# EAGLE design ecu-nowy (EAGLE 5.10)
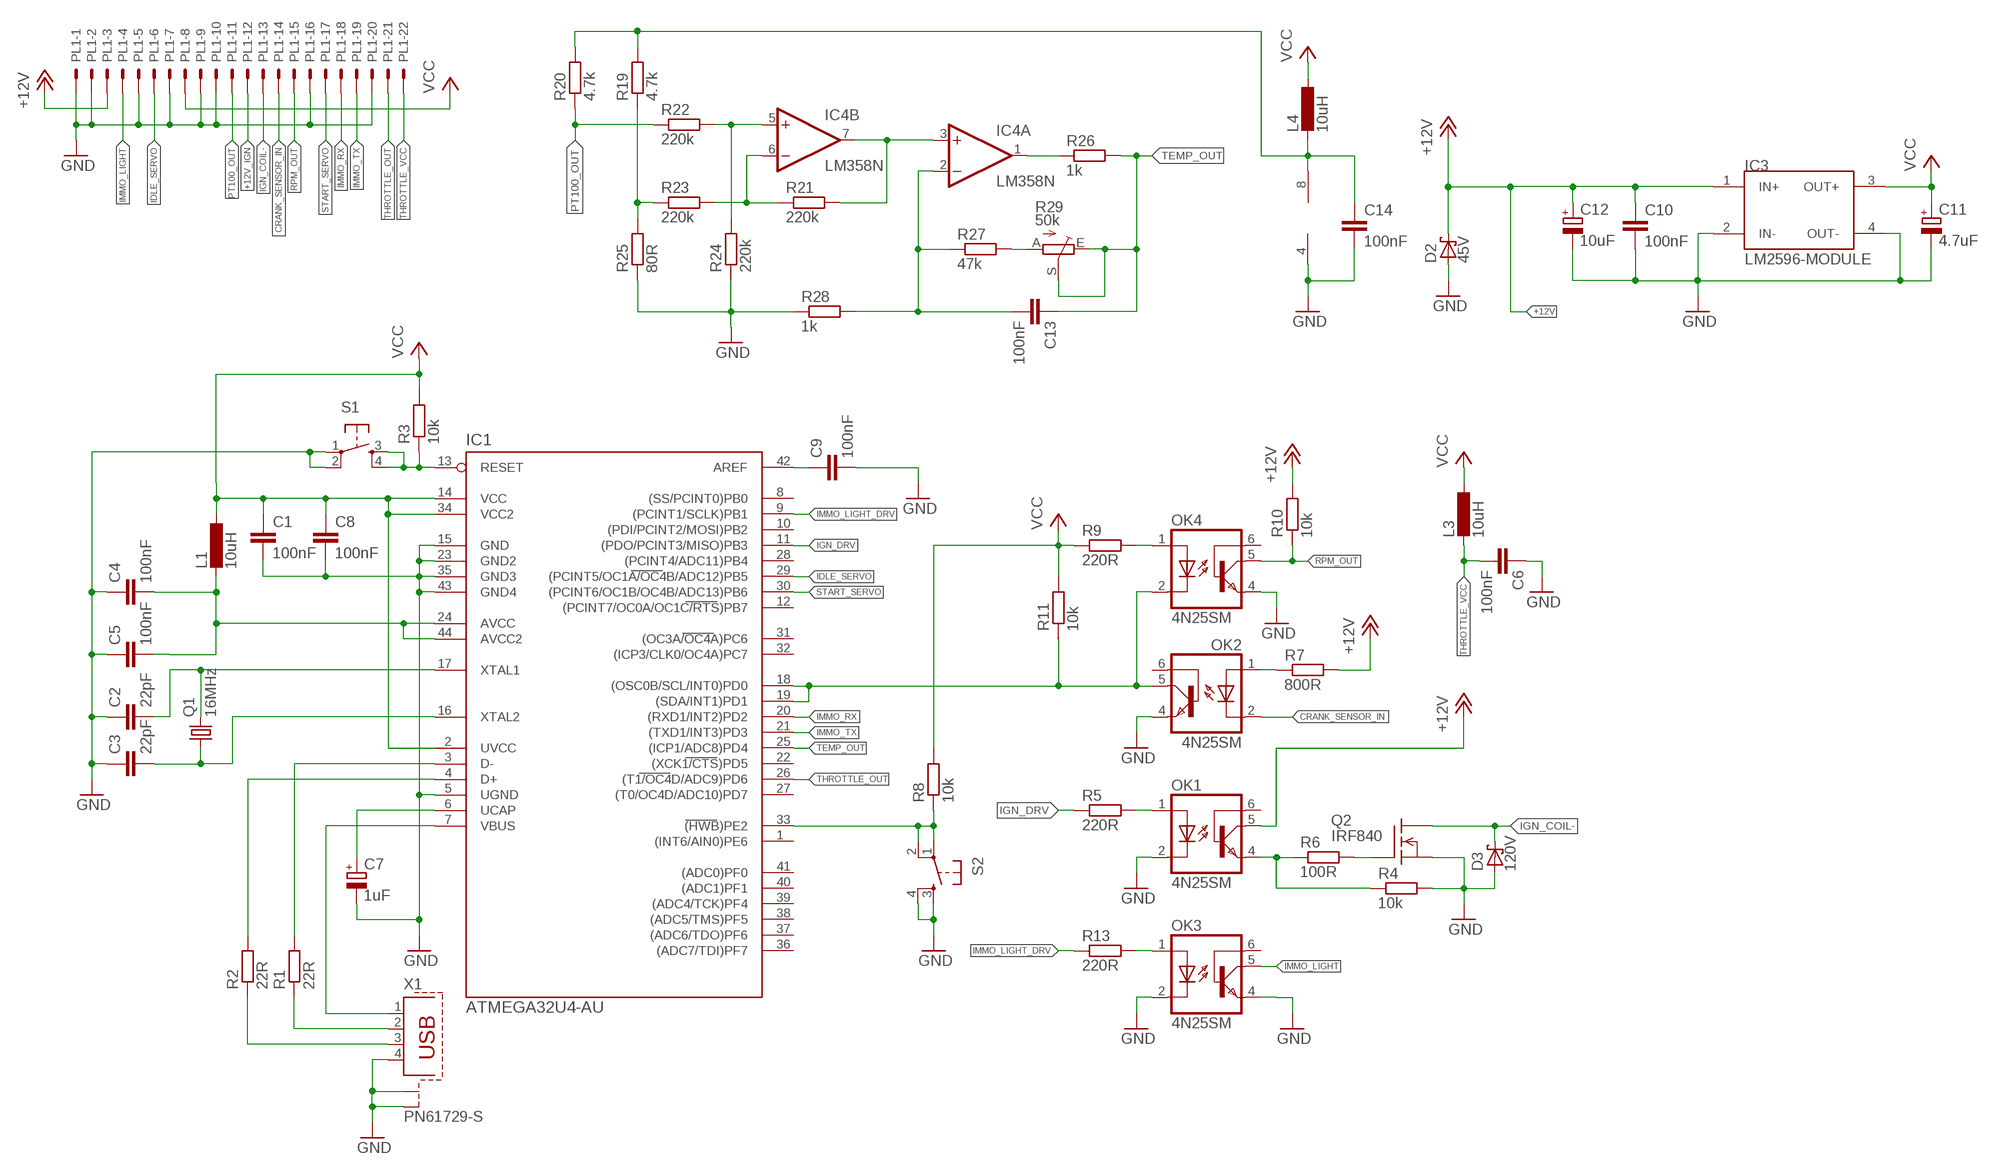
[diagram p0: schematic, sheet 1]

## Parts
C1  100nF  C-EUC0805  [C0805]
C2  22pF  C-EUC0805  [C0805]
C3  22pF  C-EUC0805  [C0805]
C4  100nF  C-EUC0805  [C0805]
C5  100nF  C-EUC0805  [C0805]
C6  100nF  C-EUC0805  [C0805]
C7  1uF  CPOL-EU153CLV-0405  [153CLV-0405]
C8  100nF  C-EUC0805  [C0805]
C9  100nF  C-EUC0805  [C0805]
C10  100nF  C-EUC0805  [C0805]
C11  4.7uF  CPOL-EU140CLH-0810  [140CLH-0810]
C12  10uF  CPOL-EU140CLH-0810  [140CLH-0810]
C13  100nF  C-EUC0805  [C0805]
C14  100nF  C-EUC0805  [C0805]
D2  45V  P4KEXX  [DO41-10]
D3  120V  P4KEXX  [DO41-10]
IC1  ATMEGA32U4-AU  [TQFP44]
IC3  LM2596-MODULE  [LM2596-MODULE]
IC4  LM358N  [DIL08]
L1  10uH  L-EU0207/10  [0207/10]
L3  10uH  L-EU0207/10  [0207/10]
L4  10uH  L-EU0207/10  [0207/10]
OK1  4N25SM  [DIL6-SMD]
OK2  4N25SM  [DIL6-SMD]
OK3  4N25SM  [DIL6-SMD]
OK4  4N25SM  [DIL6-SMD]
PL1  555X-22H  [5569-22]
Q1  16MHz  CRYSTALHC49UP  [HC49UP]
Q2  IRF840  [TO220]
R1  22R  R-EU_R0805  [R0805]
R2  22R  R-EU_R0805  [R0805]
R3  10k  R-EU_R0805  [R0805]
R4  10k  R-EU_R0805  [R0805]
R5  220R  R-EU_R0805  [R0805]
R6  100R  R-EU_R0805  [R0805]
R7  800R  R-EU_R0805  [R0805]
R8  10k  R-EU_R0805  [R0805]
R9  220R  R-EU_R0805  [R0805]
R10  10k  R-EU_R0805  [R0805]
R11  10k  R-EU_R0805  [R0805]
R13  220R  R-EU_R0805  [R0805]
R19  4.7k  R-EU_R0805  [R0805]
R20  4.7k  R-EU_R0805  [R0805]
R21  220k  R-EU_R0805  [R0805]
R22  220k  R-EU_R0805  [R0805]
R23  220k  R-EU_R0805  [R0805]
R24  220k  R-EU_R0805  [R0805]
R25  80R  R-EU_R0805  [R0805]
R26  1k  R-EU_R0805  [R0805]
R27  47k  R-EU_R0805  [R0805]
R28  1k  R-EU_R0805  [R0805]
R29  50k  TRIM_EU-S75P  [S75P]
S1  TAC_SWITCHPTH  [TACTILE-PTH]
S2  TAC_SWITCHPTH  [TACTILE-PTH]
X1  PN61729-S  [PN61729-S]

## Nets
+12V: C10.1 C12.+ D2.C IC3.1(IN+) OK1.5(COL) PL1.3 R7.2 R10.2
+12V_IGN: PL1.12
CRANK_SENSOR_IN: OK2.2(C) PL1.14
GND: C1.2 C2.1 C3.1 C4.1 C5.1 C6.1 C7.- C8.2 C9.2 C10.2 C11.- C12.- C14.2 D2.A D3.A IC1.5(UGND) IC1.15(GND) IC1.23(GND2) IC1.35(GND3) IC1.43(GND4) IC3.2(IN-) IC3.4(OUT-) IC4.4(P:V-) OK1.2(C) OK2.4(EMI) OK3.2(C) OK3.4(EMI) OK4.4(EMI) PL1.1 PL1.2 PL1.5 PL1.7 PL1.9 PL1.10 PL1.16 PL1.20 Q2.3(S) R4.2 R24.1 R25.1 R28.1 S1.1 S1.2 S2.3 S2.4 X1.4 X1.S1 X1.S2
IDLE_SERVO: IC1.29((PCINT5/OC1A/OC4B/ADC12)PB5) PL1.6
IGN_COIL-: D3.C PL1.13 Q2.2(D)
IGN_DRV: IC1.11((PDO/PCINT3/MISO)PB3) R5.1
IMMO_LIGHT: OK3.5(COL) PL1.4
IMMO_LIGHT_DRV: IC1.9((PCINT1/SCLK)PB1) R13.1
IMMO_RX: IC1.20((RXD1/INT2)PD2) PL1.18
IMMO_TX: IC1.21((TXD1/INT3)PD3) PL1.19
N$1: C4.2 C5.2 IC1.24(AVCC) IC1.44(AVCC2) L1.2
N$2: C14.1 IC4.8(P:V+) L4.2 R19.2 R20.2
N$3: C2.2 IC1.17(XTAL1) Q1.2
N$4: C3.2 IC1.16(XTAL2) Q1.1
N$5: IC1.13(RESET) R3.1 S1.3 S1.4
N$6: C7.+ IC1.6(UCAP)
N$7: IC1.33((HWB)PE2) R8.1 S2.1 S2.2
N$8: C9.1 IC1.42(AREF)
N$10: IC1.7(VBUS) X1.1
N$11: R1.1 X1.2
N$12: R2.1 X1.3
N$13: IC1.3(D-) R1.2
N$14: Q2.1(G) R6.2
N$15: OK1.1(A) R5.2
N$16: OK1.4(EMI) R4.1 R6.1
N$17: IC1.18((OSC0B/SCL/INT0)PD0) IC1.19((SDA/INT1)PD1) OK2.5(COL) OK4.2(C) R11.1
N$18: OK2.1(A) R7.1
N$21: OK4.1(A) R9.2
N$22: IC1.4(D+) R2.2
N$24: OK3.1(A) R13.2
N$29: R19.1 R23.1 R25.2
N$32: IC4.6(B:-IN) R21.1 R23.2
N$33: IC4.3(A:+IN) IC4.7(B:OUT) R21.2
N$34: IC4.5(B:+IN) R22.2 R24.2
N$35: IC4.1(A:OUT) R26.1
N$36: C13.2 IC4.2(A:-IN) R27.1 R28.2
N$38: R27.2 R29.A
PT100_OUT: PL1.11 R20.1 R22.1
RPM_OUT: OK4.5(COL) PL1.15 R10.1
START_SERVO: IC1.30((PCINT6/OC1B/OC4B/ADC13)PB6) PL1.17
TEMP_OUT: C13.1 IC1.25((ICP1/ADC8)PD4) R26.2 R29.E R29.S
THROTTLE_OUT: IC1.26((T1/OC4D/ADC9)PD6) PL1.21
THROTTLE_VCC: C6.2 L3.2 PL1.22
VCC: C1.1 C8.1 C11.+ IC1.2(UVCC) IC1.14(VCC) IC1.34(VCC2) IC3.3(OUT+) L1.1 L3.1 L4.1 PL1.8 R3.2 R8.2 R9.1 R11.2
Unconnected: IC1.1((INT6/AIN0)PE6) IC1.8((SS/PCINT0)PB0) IC1.10((PDI/PCINT2/MOSI)PB2) IC1.12((PCINT7/OC0A/OC1C/RTS)PB7) IC1.22((XCK1/CTS)PD5) IC1.27((T0/OC4D/ADC10)PD7) IC1.28((PCINT4/ADC11)PB4) IC1.31((OC3A/OC4A)PC6) IC1.32((ICP3/CLK0/OC4A)PC7) IC1.36((ADC7/TDI)PF7) IC1.37((ADC6/TDO)PF6) IC1.38((ADC5/TMS)PF5) IC1.39((ADC4/TCK)PF4) IC1.40((ADC1)PF1) IC1.41((ADC0)PF0) OK1.6(BAS) OK2.6(BAS) OK3.6(BAS) OK4.6(BAS)

## Library data of the parts
C1-C5 C8-C10 = resistor:C-EU: CAPACITOR, European symbol
C6 C13 C14 = rcl:C-EU: CAPACITOR, European symbol
C7 C11 C12 = rcl:CPOL-EU: POLARIZED CAPACITOR, European symbol
D2 D3 = diode:P4KEXX: DIODE transient-voltage suppressor
IC1 = mega32U4:ATMEGA32U4-AU
IC3 = moja:LM2596-MODULE
IC4 = linear:LM358: OP AMP also LM158; LM258; LM2904 Source: http://cache.national.com/ds/LM/LM158.pdf
L1 L3 L4 = rcl:L-EU: INDUCTOR, European symbol
OK1-OK4 = optocoupler:4N*?M: General Purpose 6-Pin Phototransistor Optocouplers Source: http://www.fairchildsemi.com/ds/4N/4N35-M.pdf
PL1 = con-molex-2:555X-22: Mini FIT connector 22 way
Q1 = crystal:CRYSTAL: CRYSTAL; OC_FARNELL: unknown; OC_NEWARK: unknown
Q2 = transistor-fet:IRF840: N-Channel Enhancement MOSFET (HEXFET); 500V; 8A; 0,85Ohm
R1-R11 R13 R19-R28 = rcl:R-EU_: RESISTOR, European symbol
R29 = pot:TRIM_EU-: POTENTIOMETER
S1 S2 = SparkFun:TAC_SWITCH: Momentary Switch Button commonly used for reset or general input. Spark Fun Electronics SKU : COM-00097
X1 = con-berg:PN61729-S: BERG USB connector; OC_FARNELL: unknown; OC_NEWARK: unknown

## Board
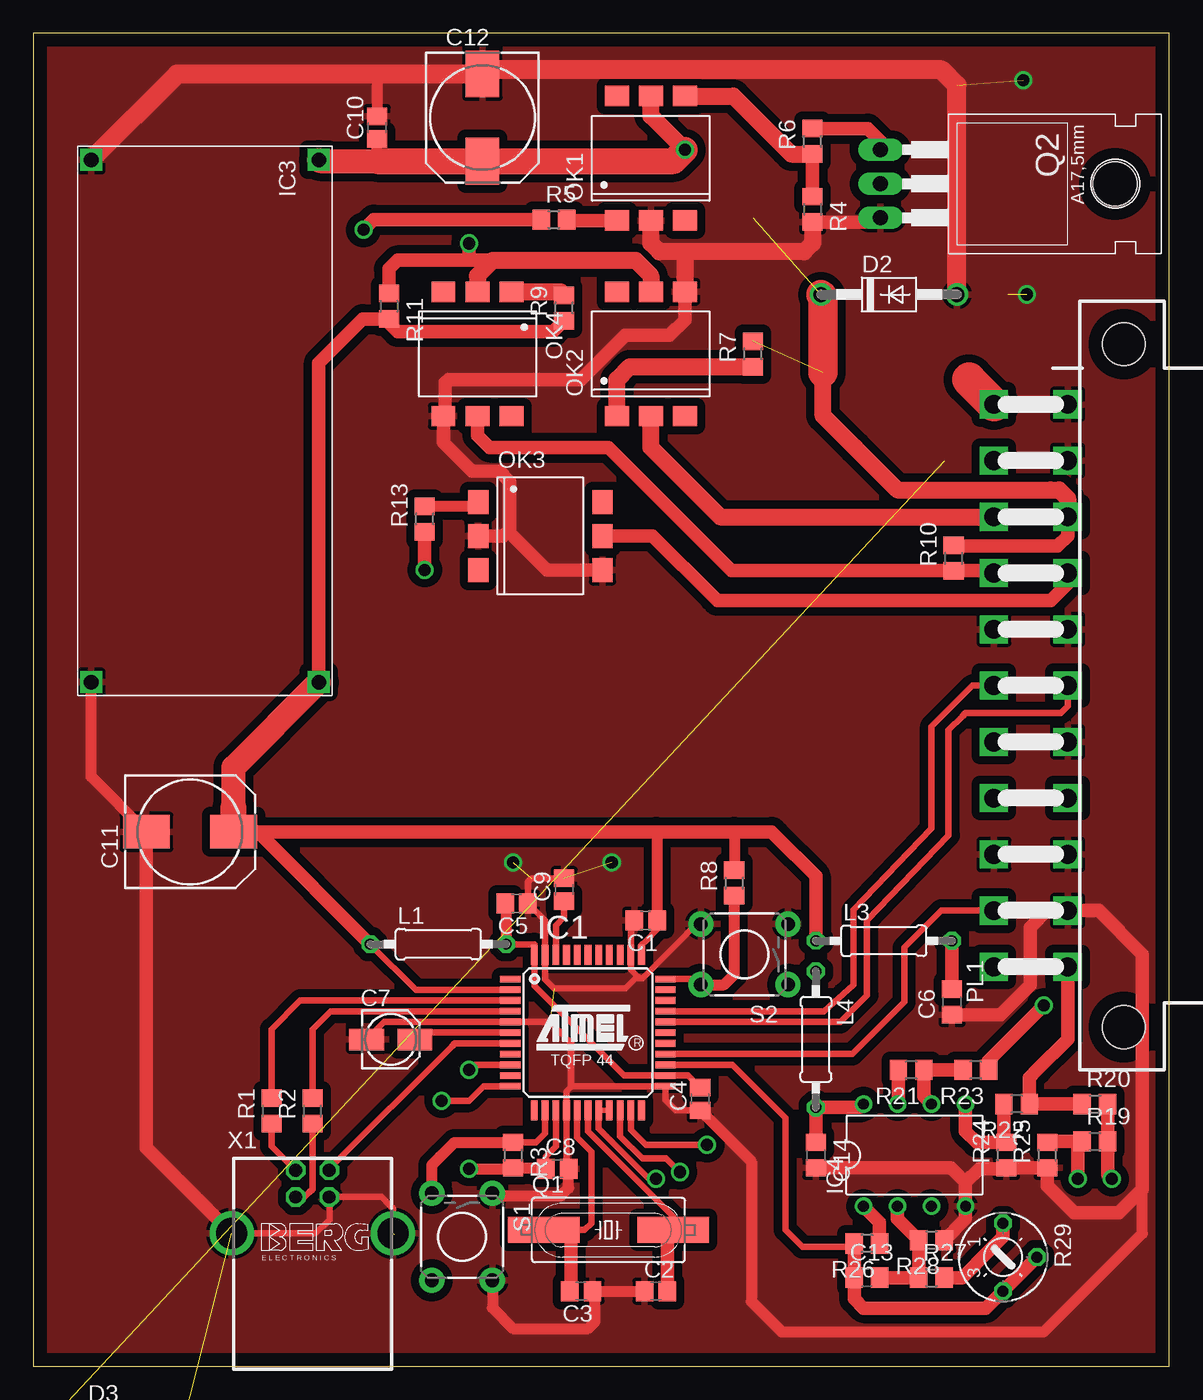
[diagram p1: board, top side]
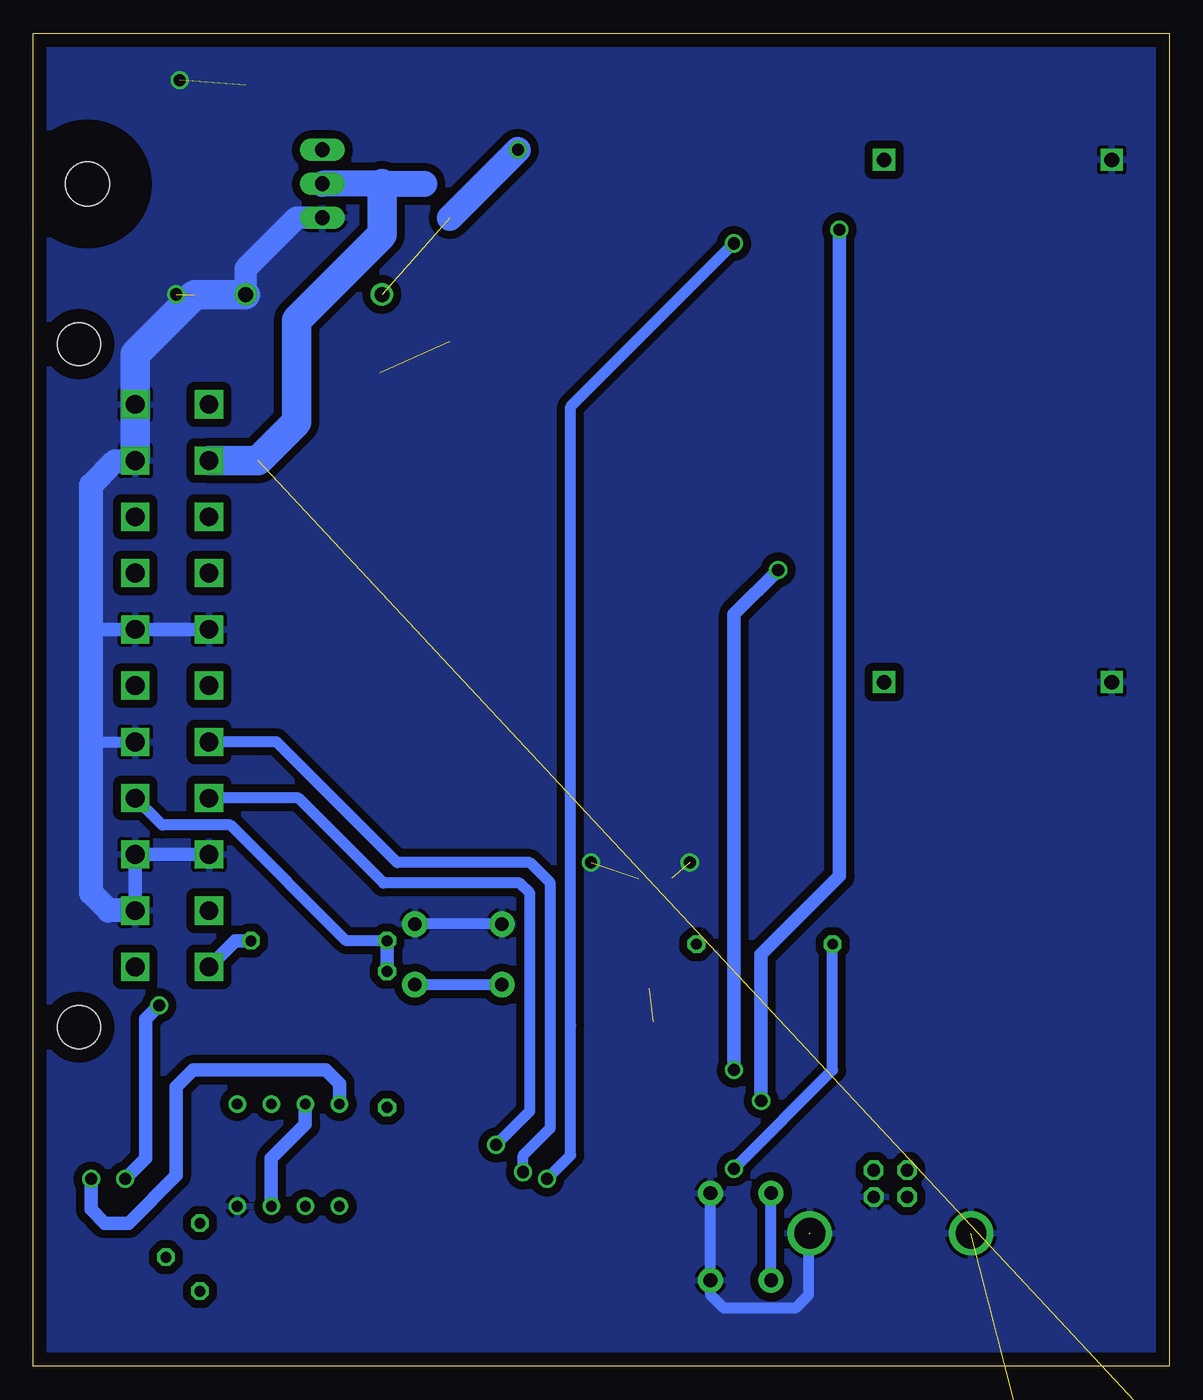
[diagram p2: board, bottom side, seen from below]

Size 84.82 x 99.49 mm. Coordinates in mm from the lower left corner, seen from the top.
Outline: 0,0 84.82,0 84.82,99.49 0,99.49 0,0
Copper layers (1*16): Top 0.035mm / dielectric 1.5mm / Bottom 0.035mm
Design rules "default": minimum track width 10mil, minimum drill 24mil, track to track 8mil, track to pad 8mil, pad to pad 8mil, via to via 8mil, smd to smd 8mil, copper to edge 40mil, drill to drill 8mil, minimum pad ring 10mil, minimum via ring 8mil, stop-mask expansion 4mil, vias tented up to drill 0mil, thermal gap 10mil

### Footprints (pad centres in the part's own frame; a part is rotated, then mirrored left to right if it is on the bottom)
C0805 = smd 1.3 x 1.5: 1 -0.85,0; 2 0.85,0
C0805' = smd 1.3 x 1.5: 1 -0.95,0; 2 0.95,0
153CLV-0405 = smd 2.6 x 1.6: + 1.8,0; - -1.8,0
140CLH-0810 = smd 3.5 x 2.5: + 3.25,0; - -3.25,0
DO41-10 = drill 1.118 round: A 5.08,0; C -5.08,0
TQFP44 = smd 1.5 x 0.5: 1 -5.8,4; 2 -5.8,3.2; 3 -5.8,2.4; 4 -5.8,1.6; 5 -5.8,0.8; 6 -5.8,0; 7 -5.8,-0.8; 8 -5.8,-1.6; 9 -5.8,-2.4; 10 -5.8,-3.2; 11 -5.8,-4; 23 5.8,-4; 24 5.8,-3.2; 25 5.8,-2.4; 26 5.8,-1.6; 27 5.8,-0.8; 28 5.8,0; 29 5.8,0.8; 30 5.8,1.6; 31 5.8,2.4; 32 5.8,3.2; 33 5.8,4 | smd 0.5 x 1.5: 12 -4,-5.8; 13 -3.2,-5.8; 14 -2.4,-5.8; 15 -1.6,-5.8; 16 -0.8,-5.8; 17 0,-5.8; 18 0.8,-5.8; 19 1.6,-5.8; 20 2.4,-5.8; 21 3.2,-5.8; 22 4,-5.8; 34 4,5.8; 35 3.2,5.8; 36 2.4,5.8; 37 1.6,5.8; 38 0.8,5.8; 39 0,5.8; 40 -0.8,5.8; 41 -1.6,5.8; 42 -2.4,5.8; 43 -3.2,5.8; 44 -4,5.8
LM2596-MODULE = drill 1.1 square: 1 1,18; 2 1,1; 3 40,18; 4 40,1
DIL08 = drill 0.813 pad 1.27 round: 1 -3.81,-3.81; 2 -1.27,-3.81; 3 1.27,-3.81; 4 3.81,-3.81; 5 3.81,3.81; 6 1.27,3.81; 7 -1.27,3.81; 8 -3.81,3.81
0207/10 = drill 0.813 octagon: 1 -5.08,0; 2 5.08,0
DIL6-SMD = smd 1.78 x 1.52: 1 -2.54,-4.645; 2 0,-4.645; 3 2.54,-4.645; 4 2.54,4.645; 5 0,4.645; 6 -2.54,4.645
5569-22 = drill 1.4 square: 1 21,0; 2 16.8,0; 3 12.6,0; 4 8.4,0; 5 4.2,0; 6 0,0; 7 -4.2,0; 8 -8.4,0; 9 -12.6,0; 10 -16.8,0; 11 -21,0; 12 21,5.5; 13 16.8,5.5; 14 12.6,5.5; 15 8.4,5.5; 16 4.2,5.5; 17 0,5.5; 18 -4.2,5.5; 19 -8.4,5.5; 20 -12.6,5.5; 21 -16.8,5.5; 22 -21,5.5 | hole 3.2: 25.5,-4.2; -25.5,-4.2
HC49UP = smd 5.334 x 1.93: 1 -4.826,0; 2 4.826,0
TO220 = drill 1.118 long: 1 -2.54,-6.35; 2 0,-6.35; 3 2.54,-6.35 | hole 3.302: 0,11.176
R0805 = smd 1.3 x 1.5: 1 -0.95,0; 2 0.95,0
S75P = drill 0.813 octagon: A -2.54,0; E 2.54,0; S 0,2.54
TACTILE-PTH = drill 1.016 pad 1.88 round: 1 -3.251,2.261; 2 3.251,2.261; 3 -3.251,-2.261; 4 3.251,-2.261
PN61729-S = drill 0.95 octagon: 1 1.25,4.71; 2 -1.25,4.71; 3 -1.25,2.71; 4 1.25,2.71 | drill 2.3 pad 2.9 round: S1 -6.02,0; S2 6.02,0

### Placement (x,y rotation side)
C1  45.72,33.27 180 top
C2  46.48,5.59 0 top
C3  40.89,5.59 180 top
C4  49.78,19.94 90 top
C5  36.07,34.54 180 top
C6  100nF  [C0805']  68.58,27.18 90 top
C7  26.67,24.38 0 top
C8  39.12,14.73 0 top
C9  39.62,35.56 90 top
C10  25.65,92.46 90 top
C11  11.68,39.88 0 top
C12  33.53,93.22 270 top
C13  100nF  [C0805']  62.23,6.6 0 top
C14  100nF  [C0805']  58.42,15.75 270 top
D2  63.88,80.01 0 top
D3  6.1,-4.32 0 top  (outside the outline)
IC1  41.4,24.89 0 top
IC3  3.3,91.06 270 top
IC4  65.79,15.75 0 top
L1  30.23,31.5 0 top
L3  63.5,31.75 0 top
L4  58.42,24.38 270 top
OK1  46.1,90.17 0 top
OK2  46.1,75.56 0 top
OK3  37.85,61.98 270 top
OK4  33.15,75.56 180 top
PL1  77.22,50.8 90 top
Q1  42.93,10.16 0 top
Q2  69.6,88.27 270 top
R1  17.78,19.05 90 top
R2  20.83,19.05 90 top
R3  35.81,15.75 270 top
R4  58.17,86.36 270 top
R5  38.86,85.6 0 top
R6  58.17,91.44 90 top
R7  53.72,75.56 90 top
R8  52.32,36.07 90 top
R9  39.62,78.99 90 top
R10  68.71,60.33 90 top
R11  26.54,79.12 270 top
R13  29.21,63.25 90 top
R19  79.25,16.76 0 top
R20  79.25,19.56 0 top
R21  65.53,22.1 180 top
R22  73.41,19.56 180 top
R23  70.36,22.1 180 top
R24  72.64,15.75 90 top
R25  75.69,15.75 90 top
R26  62.23,9.14 180 top
R27  67.06,6.6 0 top
R28  67.06,9.4 180 top
R29  72.39,8.13 270 top
S1  32,9.65 270 top
S2  53.09,30.73 180 top
X1  20.83,9.91 0 top

### Tracks (layer width: path | path; a pad name or v marks a point on that pad's centre or on a via)
+12V  (via drill 0.9)  (2 unrouted)
  Top 0.813: 25.65,89.97 C10.1
  Top 1.016: R10.2 68.77,61.21 76.2,61.21 76.45,61.21 77.22,61.98 PL1.3
  Top 1.27: v48.64,90.8 46.1,93.34 OK1.5 | PL1.3 77.22,64.77 76.58,65.41 75.95,65.41 64.52,65.41 61.34,68.58 58.96,70.96 58.96,74.17
  Top 1.778: 25.65,89.97 21.39,89.97 IC3.1
  Top 1.93: v48.64,90.8 47.8,89.97 C12.+ 25.65,89.97
  Top 2.184: 58.96,74.17 58.96,79.85 D2.C
  Bottom 1.93: v48.64,90.8 53.72,85.72
+12V_IGN
  Top 2.54: PL1.12 69.86,73.66
CRANK_SENSOR_IN
  Top 1.27: PL1.14 51.28,63.4 46.1,68.58 OK2.2
GND  (via drill 0.9)  (7 unrouted)
  Top 0.5: 40.2,20.89 IC1.23 47.2,19.85 47.75,19.3 47.97,19.09 C4.1 | 40.2,20.89 40.13,20.83 39.8,20.5 IC1.15 39.8,14.9 C8.2 | 38.99,25.27 40.13,24.13 40.13,20.96 40.2,20.89 | 38.99,25.27 38.61,25.65 | 38.61,25.65 38.57,25.69 IC1.5 26.18,25.69 C7.- | 38.99,25.27 38.61,25.65 | C1.2 44.6,33.01 IC1.35 44.6,29.57 45.09,29.08 | C9.2 37.17,36.41 37.08,36.32 36.92,36.16 C5.1 38.2,33.26 IC1.43 38.2,28.85 38.61,28.45 38.86,28.19 44.2,28.19 44.6,28.6 45.09,29.08 | X1.S2 26.85,11.76 26.67,11.94 25.99,12.62 X1.4 22.1,12.6 22.1,10.92 21.08,9.91 X1.S1 | 45.09,29.08 45.21,28.96 45.47,28.96 48.01,31.5 49.51,33 S2.4
  Top 0.813: C2.1 C3.1 41.91,5.42 41.91,3.3 41.4,2.79 35.81,2.79 34.27,4.34 S1.2 | 25.65,96.47 C10.2 | 33.83,96.77 C12.- | C11.- 4.3,44.01 IC3.4 | C4.1 53.59,15.28 53.59,4.83 55.88,2.54 75.44,2.54 82.8,9.91 82.8,13.46 | S1.1 34.47,12.7 39.37,12.7 39.97,13.3 C8.2
  Top 1.016: Q2.3 62.93,85.41 R4.2 | OK2.4 48.64,78.1 47.5,76.96 44.2,76.96 40.89,73.66 39.88,73.66 33.02,73.66 30.99,73.66 30.73,73.41 30.73,71.05 OK4.4 30.61,68.96 32.77,66.8 34.8,66.8 35.56,66.04 35.56,62.48 35.43,62.36 | R28.1 69.6,10.99 IC4.4 69.6,13.72 | 69.6,13.72 70.61,14.73 72.58,14.73 R24.1 R25.1 75.69,13.46 77.72,11.43 81.03,11.43 82.8,13.21 82.8,13.46 82.8,30.73 79.54,34 PL1.10 77.18,34.04 75.69,34.04 74.42,32.77 74.42,28.45 72.2,26.23 C6.1 | 69.6,13.72 68.51,14.8 C14.2 | 35.43,62.36 35.05,61.98 OK3.2 | OK3.4 38.35,59.44 35.43,62.36 | C11.- 8.43,16.28 X1.S1
  Top 1.27: OK1.2 46.1,83.82 46.74,83.18 48.51,83.18 | 48.51,83.18 57.53,83.18 58.17,83.82 R4.2 | OK2.4 48.64,81.28 48.64,83.06 48.51,83.18
  Top 1.422: D2.A 68.96,95.63 67.82,96.77 33.83,96.77 C12.- 25.65,96.47 10.71,96.47 IC3.2
  Bottom 0.813: PL1.7 80.4,46.6 80.52,46.48 | S2.4 S2.3 | S1.1 S1.2 34.27,5.31 33.27,4.32 27.94,4.32 26.92,5.33 26.92,9.83
  Bottom 1.016: PL1.10 77.38,34.16 77.22,34.33 PL1.9 PL1.20 | PL1.16 PL1.5 80.15,55 80.52,55.37
  Bottom 1.676: Q2.3 65.15,85.72 68.96,81.91 D2.A
  Bottom 1.778: PL1.2 77.25,67.56 78.74,67.56 80.52,65.79 80.52,55.37 80.52,46.48 80.52,35.31 79.21,34 PL1.10
  Bottom 2.184: D2.A 72.77,80.01 77.22,75.56 PL1.1 PL1.2
  other vias: 35.81,37.59 43.18,37.59 73.91,96.01 74.17,80.01
  pour Bottom (isolate 0.61): 0.25,99.31 84.84,99.31 84.84,0.25 0.25,0.25
  pour Top (isolate 0.61): 0,99.57 84.84,99.57 84.84,0.51 0,0.51
IDLE_SERVO
  Top 0.5: IC1.29 60.24,25.69 62.23,27.69 62.23,33.27 68.33,39.62 68.33,47.5 69.34,48.51 69.6,48.77 76.71,48.77 77.22,49.28 PL1.6
IGN_COIL-  (1 unrouted)
  Bottom 1.93: 55.63,88.27 58.8,88.27 Q2.2
  Bottom 2.184: PL1.13 68.04,67.6 65.15,70.48 65.15,78.1 58.8,84.45 58.8,88.27
IGN_DRV  (via drill 0.9)
  Top 0.5: IC1.11 33.59,20.89 32.51,19.81 v30.48,19.81
  Top 1.016: R5.1 25.4,85.6 v24.64,84.84
  Bottom 1.016: v24.64,84.84 24.64,36.58 30.48,30.73 v30.48,19.81
IMMO_LIGHT
  Top 1.016: OK3.5 46.23,61.98 50.8,57.4 51.05,57.15 74.17,57.15 75.95,57.15 77.22,58.42 PL1.4
IMMO_LIGHT_DRV  (via drill 0.9)
  Top 0.5: IC1.9 32.91,22.49 v32.51,22.1
  Top 1.016: v29.21,59.44 R13.1
  Bottom 1.016: v32.51,22.1 32.51,56.13 v29.21,59.44
IMMO_RX  (via drill 0.9)
  Top 0.5: IC1.20 43.8,17.16 45.47,15.49 47.24,15.49 v48.26,14.48
  Bottom 0.813: 62.1,42.04 62.48,42.42 | PL1.18 66.67,46.6 62.1,42.04 | 62.1,42.04 57.66,37.59 47.75,37.59 46.23,36.07 46.23,17.78 48.26,15.75 v48.26,14.48
IMMO_TX  (via drill 0.9)
  Top 0.5: IC1.21 44.6,17.63 45.72,16.51 v50.29,16.51
  Bottom 0.813: PL1.19 65.01,42.4 62.99,40.39 62.23,39.62 58.67,36.07 48.51,36.07 47.75,35.31 47.75,29.21 47.75,19.05 v50.29,16.51
N$1
  Top 0.5: C4.2 48.88,21.69 IC1.24 44.09,21.69 43.94,21.84 37.4,28.38 IC1.44 37.4,31.5 L1.2 | C5.2 35.22,34.12
  Top 0.813: L1.2 35.31,34.46 C5.2
N$2  (via drill 0.9)
  Top 1.016: R20.2 80.2,17.27 R19.2 80.2,14.29 v80.52,13.97 | C14.1 L4.2 61.72,19.3 IC4.8
  Bottom 1.016: IC4.8 61.98,21.08 62.99,22.1 72.9,22.1 74.17,20.83 74.17,14.22 77.72,10.67 79.5,10.67 80.52,11.68 v80.52,13.97
N$3
  Top 0.5: IC1.17 41.4,17.53 47.75,11.18 Q1.2
  Top 1.016: Q1.2 47.33,9.74 C2.2
N$4
  Top 0.5: Q1.1 40.13,10.16 41.15,10.16 41.66,10.67 41.66,16 40.6,17.06 IC1.16
  Top 1.016: C3.2 40.13,5.68 40.13,10.16
N$5
  Top 0.5: IC1.13 38.2,17.37 37.59,16.76 37.53,16.7 R3.1
  Top 0.813: R3.1 31.43,16.7 31.24,16.51 30.35,15.62 29.74,15.01 S1.3
  Bottom 0.813: S1.4 S1.3
N$6
  Top 0.5: IC1.6 28.98,24.89 C7.+
N$7
  Top 0.5: IC1.33 49.42,28.89 S2.2
  Top 0.813: R8.1 52.32,29.23 51.56,28.47 S2.2
  Bottom 0.813: S2.2 S2.1
N$8
  Top 0.5: IC1.42 39,32.91 39.62,33.53 C9.1
N$10
  Top 0.5: IC1.7 31.46,24.09 31.24,23.88 22.08,14.71 X1.1
N$11
  Top 0.5: X1.2 17.78,16.41 R1.1
N$12
  Top 0.5: X1.3 20.24,12.62 20.57,12.95 20.83,13.21 20.83,16.51 R2.1
N$13
  Top 0.5: IC1.3 19.93,27.29 17.78,25.15 R1.2
N$14
  Top 1.016: Q2.1 63.25,91.44 62.3,92.39 R6.2
N$15
  Top 1.016: R5.2 39.88,85.52 OK1.1
N$16
  Top 1.016: R6.1 R4.1
  Top 1.27: OK1.4 52.25,94.81 56.26,90.8 56.58,90.49 R6.1
N$17  (via drill 0.9)
  Top 0.406: IC1.18 IC1.19
  Top 0.5: IC1.18 42.2,17.74 45.97,13.97 v46.48,13.97
  Top 1.016: R11.1 26.54,81.91 27.18,82.55 32.51,82.55 | 32.51,82.55 34.04,82.55 34.16,82.42 | v32.51,83.82 32.51,82.55
  Top 1.27: OK2.5 46.1,81.41 45.72,81.79 44.96,82.55 35.56,82.55 34.29,82.55 34.16,82.42 33.15,81.41 OK4.2
  Bottom 0.813: v46.48,13.97 44.7,15.75 44.7,25.4 44.7,71.63 v32.51,83.82
N$18
  Top 1.27: R7.1 44.52,74.61 43.56,73.66 OK2.1
N$21
  Top 1.27: OK4.1 39.36,80.21 R9.2
N$22
  Top 0.5: IC1.4 22.17,26.49 20.83,25.15 R2.2
N$24
  Top 0.813: OK3.1 32.88,64.2 R13.2
N$29  (via drill 0.9)
  Top 1.016: R25.2 75.76,16.76 R19.1 77.98,16.44 v77.98,13.97 | R23.1 71.31,22.79 v75.44,26.92
  Bottom 1.016: v75.44,26.92 76.45,25.91 76.45,15.49 v77.98,13.97
N$32
  Top 1.016: IC4.6 66.48,20.13 R21.1 R23.2
N$33
  Top 1.016: IC4.7 64.58,19.62 R21.2
  Bottom 1.016: IC4.7 64.52,18.03 67.06,15.49 IC4.3
N$34
  Top 1.016: IC4.5 69.6,17.53 70.42,16.7 R24.2 72.46,16.89 R22.2
N$35
  Top 1.016: R26.1 63.18,10.73 IC4.1
N$36
  Top 1.016: IC4.2 64.52,10.99 R28.2 R27.1 C13.2
N$38
  Top 1.016: R27.2 69.34,6.6 71.37,8.64 72.39,9.65 R29.A
PT100_OUT
  Top 1.016: R20.1 R22.1 74.36,21.52 74.93,22.1 77.22,24.38 PL1.11
RPM_OUT
  Top 1.016: PL1.15 71.54,59.38 R10.1 52.13,59.38 49.53,61.98 42.93,68.58 34.04,68.58 33.15,69.47 OK4.5
START_SERVO
  Top 0.5: IC1.30 59,26.49 61.21,28.45 61.21,34.04 67.06,40.13 67.06,47.75 70.1,50.8 PL1.17
TEMP_OUT
  Top 0.5: IC1.25 52.18,22.49 56.13,18.54 56.13,10.16 57.4,8.89 61.03,8.89 R26.2
  Top 1.016: R29.S R29.E 71.12,4.32 61.98,4.32 61.28,5.01 C13.1 R26.2
THROTTLE_OUT
  Top 0.5: IC1.26 61.14,23.29 62.74,24.89 65.02,27.18 65.02,31.24 67.78,34 PL1.21
THROTTLE_VCC
  Top 1.016: C6.2 L3.2
  Bottom 1.016: PL1.22 69.77,31.75 L3.2
VCC  (via drill 0.9)
  Top 0.5: IC1.34 45.4,31.43 45.72,31.75 46.57,32.6 C1.1 | 35.88,14.73 R3.2 | IC1.14 39,16.4 38.35,15.75 38.27,15.66 C8.1 | IC1.2 28.55,28.09 L1.1
  Top 0.813: v32.51,14.73 35.88,14.73 | C8.1 38.2,14.8 R3.2 | 52.32,39.88 R8.2 | C1.1 46.57,39.79 46.48,39.88
  Top 1.016: R9.1 38.8,77.22 27.18,77.22 26.54,77.85 R11.2 24.58,78.17 22.3,75.9 21.3,74.9 IC3.3 | 15.49,39.88 16.76,39.88 L1.1 | 15.49,39.88 C11.+ 15.19,39.62 | L3.1 58.42,36.58 55.37,39.62 55.12,39.88 52.32,39.88 46.48,39.88 15.49,39.88
  Top 1.778: 14.93,41.69 14.93,44.69 IC3.3
  Top 1.93: C11.+ 14.93,41.69
  Bottom 0.813: L3.1 61.47,31.75 70.1,40.39 75.2,40.39 PL1.8 | v32.51,14.73 25.15,22.1 L1.1
  Bottom 1.016: L3.1 L4.1